# Altium schematic sheet Outputs.SchDoc: Outputs
size Letter; Date: 2019-07-18; DocumentNumber: 3; Revision: B; SheetNumber: 3; SheetTotal: 7; ProjectTitle: SDRdrum Arty Shield; PageSetup: Record=PageOptions|CenterHorizontal=True|CenterVertical=True|PrintScale=0.98|XCorrection=1.00|YCorrection=1.00|PrintKind=2|BorderSize=5000000|LeftOffset=0|BottomOffset=0|Orientation=2|PaperLength=1000|PaperWidth=1000|Scale=100|PaperSource=7|PrintQuality=-3|MediaType=1|DitherType=10|PrintScaleMode=1|PaperKind=Tabloid|PaperIndex=3
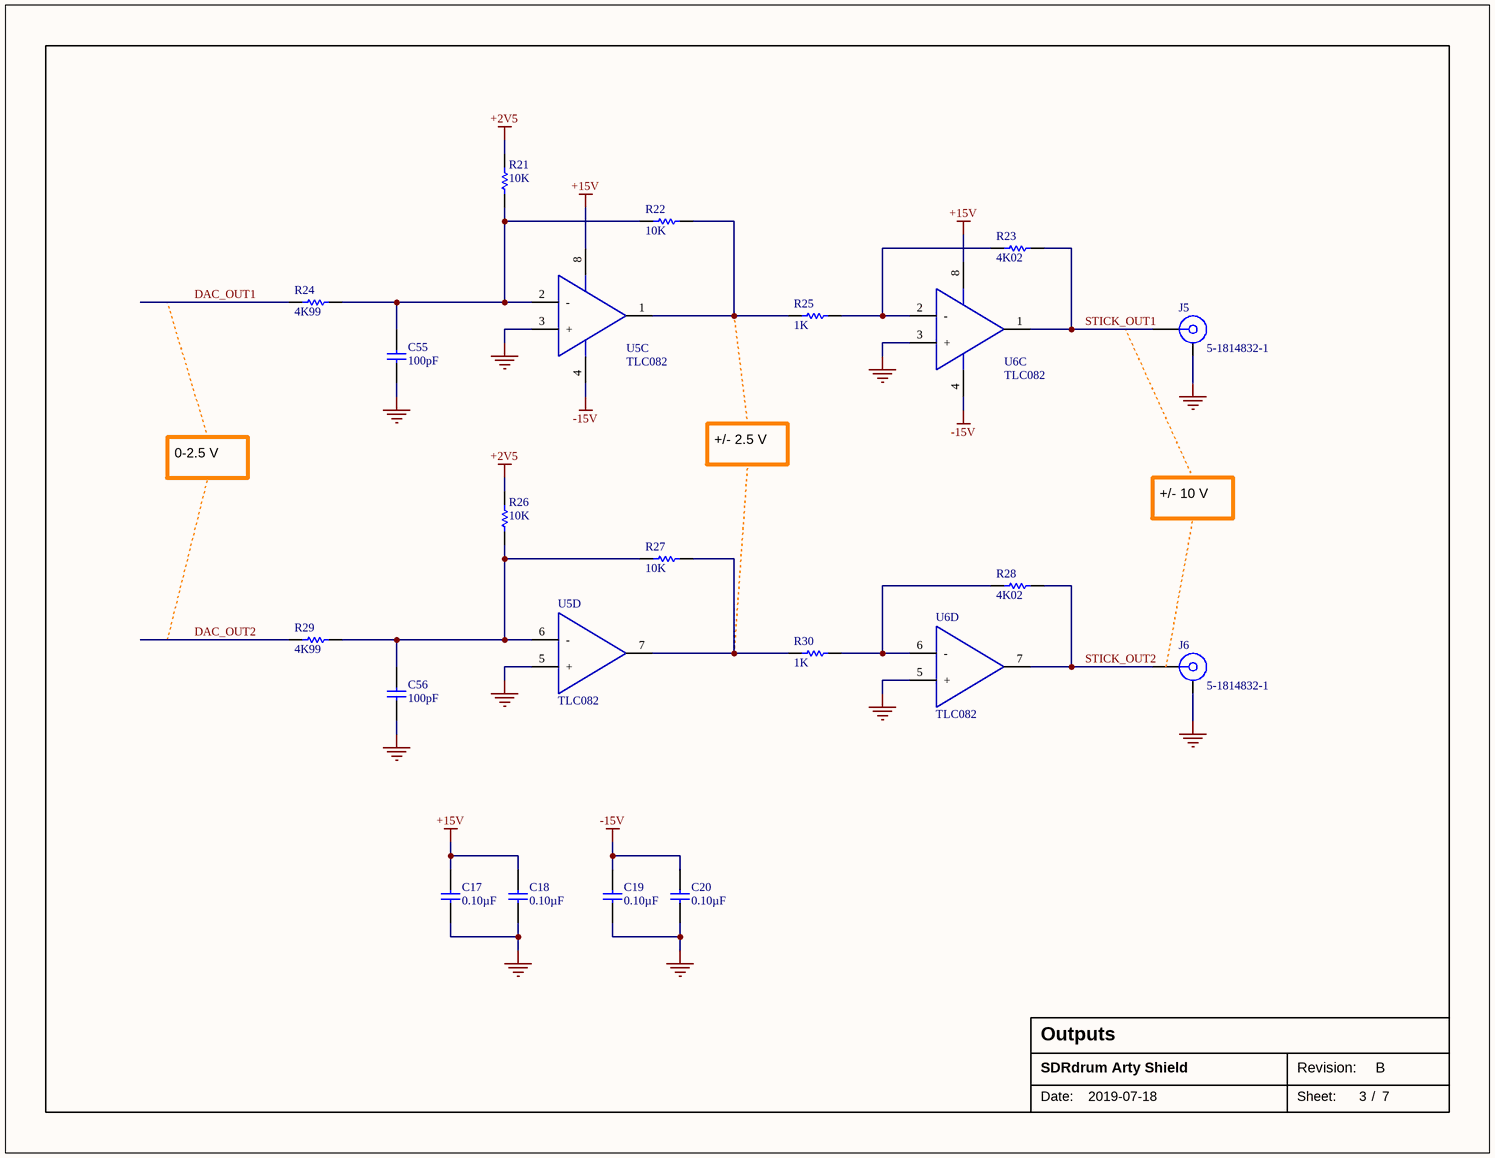
[diagram p0: Outputs.SchDoc]

## Parts
C17  value 0.10µF  [CAP-0402-M]  (hidden comment: Capacitor)
C18  value 0.10µF  [CAP-0402-M]  (hidden comment: Capacitor)
C19  value 0.10µF  [CAP-0402-M]  (hidden comment: Capacitor)
C20  value 0.10µF  [CAP-0402-M]  (hidden comment: Capacitor)
C55  value 100pF  [CAP-0603-M]  (hidden comment: CAP 100pF ±5% 50V 0603 C0G, NP0)
C56  value 100pF  [CAP-0603-M]  (hidden comment: CAP 100pF ±5% 50V 0603 C0G, NP0)
J5  5-1814832-1  [5-1814832-1]
J6  5-1814832-1  [5-1814832-1]
R21  value 10K  [RES-0603-M]  (hidden comment: RES 10K 1% 1/10 W 0603 ±100ppm/°C)
R22  value 10K  [RES-0603-M]  (hidden comment: RES 10K 1% 1/10 W 0603 ±100ppm/°C)
R23  value 4K02  [RES-0603-M]  (hidden comment: RES 4K02 1% 1/10 W 0603 ±100ppm/°C)
R24  value 4K99  [RES-0603-M]  (hidden comment: RES 4K99 1% 1/10 W 0603 ±100ppm/°C)
R25  value 1K  [RES-0603-M]  (hidden comment: RES 1K 1% 1/10 W 0603 ±100ppm/°C)
R26  value 10K  [RES-0603-M]  (hidden comment: RES 10K 1% 1/10 W 0603 ±100ppm/°C)
R27  value 10K  [RES-0603-M]  (hidden comment: RES 10K 1% 1/10 W 0603 ±100ppm/°C)
R28  value 4K02  [RES-0603-M]  (hidden comment: RES 4K02 1% 1/10 W 0603 ±100ppm/°C)
R29  value 4K99  [RES-0603-M]  (hidden comment: RES 4K99 1% 1/10 W 0603 ±100ppm/°C)
R30  value 1K  [RES-0603-M]  (hidden comment: RES 1K 1% 1/10 W 0603 ±100ppm/°C)
U5  TLC082  [SOIC127P600X175-8M]  (parts C,D of 4)
U6  TLC082  [SOIC127P600X175-8M]  (parts C,D of 4)

## Nets
+2V5: R21.2 R26.2
+15V: C17.1 C18.1 U5.8(V+) U6.8(V+)
-15V: C19.1 C20.1 U5.4(V-) U6.4(V-)
GND: C17.2 C18.2 C19.2 C20.2 C55.1 C56.1 J5.MH J6.MH U5.3(+) U5.5(+) U6.3(+) U6.5(+)
DAC_OUT1: R24.1
DAC_OUT2: R29.1
STICK_OUT1: J5.1 R23.2 U6.1(OUT1)
STICK_OUT2: J6.1 R28.2 U6.7(OUT1)
NetC55_2: C55.2 R21.1 R22.1 R24.2 U5.2(-)
NetC56_2: C56.2 R26.1 R27.1 R29.2 U5.6(-)
NetR22_2: R22.2 R25.1 U5.1(OUT1)
NetR23_1: R23.1 R25.2 U6.2(-)
NetR27_2: R27.2 R30.1 U5.7(OUT1)
NetR28_1: R28.1 R30.2 U6.6(-)

## Notes on the sheet
- 0-2.5 V
- +/- 2.5 V
- +/- 10 V
- Date:
- Revision:
- Sheet:
- /

## Library data of the parts
C17-C20 = CC0402KRX5R6BB104: Manufacturer: Yageo; Manufacturer Series: CC; Tolerance: ±10%; Voltage: 10V; Temperature Coefficient: X5R; Part Number: CC0402KRX5R6BB104; Component Type: Standard; Package: 0402; Temperature Range: -55°C ~ 85°C; Supplier 1: Digi-Key; Supplier Part Number 1: 311-1336-1-ND
C55 C56 = CC0603JRNPO9BN101: Manufacturer: Yageo; Manufacturer Series: CC; Part Number: CC0603JRNPO9BN101; Component Type: Standard; Tolerance: ±5%; Voltage: 50V; Package: 0603; Temperature Coefficient: C0G, NP0; Temperature Range: -55°C ~ 125°C; Supplier 1: Digi-Key; Supplier Part Number 1: 311-1069-1-ND
R21 R22 R26 R27 = RC0603FR-0710KL: Manufacturer: Yageo; Manufacturer Series: RC; Power: 1/10 W; Part Number: RC0603FR-0710KL; Component Type: Standard; Tolerance: 1%; Package: 0603; Temperature Coefficient: ±100ppm/°C; Temperature Range: -55°C ~ 155°C; Supplier 1: Digi-Key; Supplier Part Number 1: 311-10.0KHRCT-ND
R23 R28 = RC0603FR-074K02L: Manufacturer: Yageo; Manufacturer Series: RC; Power: 1/10 W; Part Number: RC0603FR-074K02L; Component Type: Standard; Tolerance: 1%; Package: 0603; Temperature Coefficient: ±100ppm/°C; Temperature Range: -55°C ~ 155°C; Supplier 1: Digi-Key; Supplier Part Number 1: 311-4.02KHRCT-ND
R24 R29 = RC0603FR-074K99L: Manufacturer: Yageo; Manufacturer Series: RC; Power: 1/10 W; Part Number: RC0603FR-074K99L; Component Type: Standard; Tolerance: 1%; Package: 0603; Temperature Coefficient: ±100ppm/°C; Temperature Range: -55°C ~ 155°C; Supplier 1: Digi-Key; Supplier Part Number 1: 311-4.99KHRCT-ND
R25 R30 = RC0603FR-071KL: Manufacturer: Yageo; Manufacturer Series: RC; Power: 1/10 W; Part Number: RC0603FR-071KL; Component Type: Standard; Tolerance: 1%; Package: 0603; Temperature Coefficient: ±100ppm/°C; Temperature Range: -55°C ~ 155°C; Supplier 1: Digi-Key; Supplier Part Number 1: 311-1.00KHRCT-ND
U5 U6 = TLC082: 36-V, PrOperational Amplifiers, 8-Pin SOIC